# Altium project QUTMS-RADIO-M2M-V00.PrjPcb
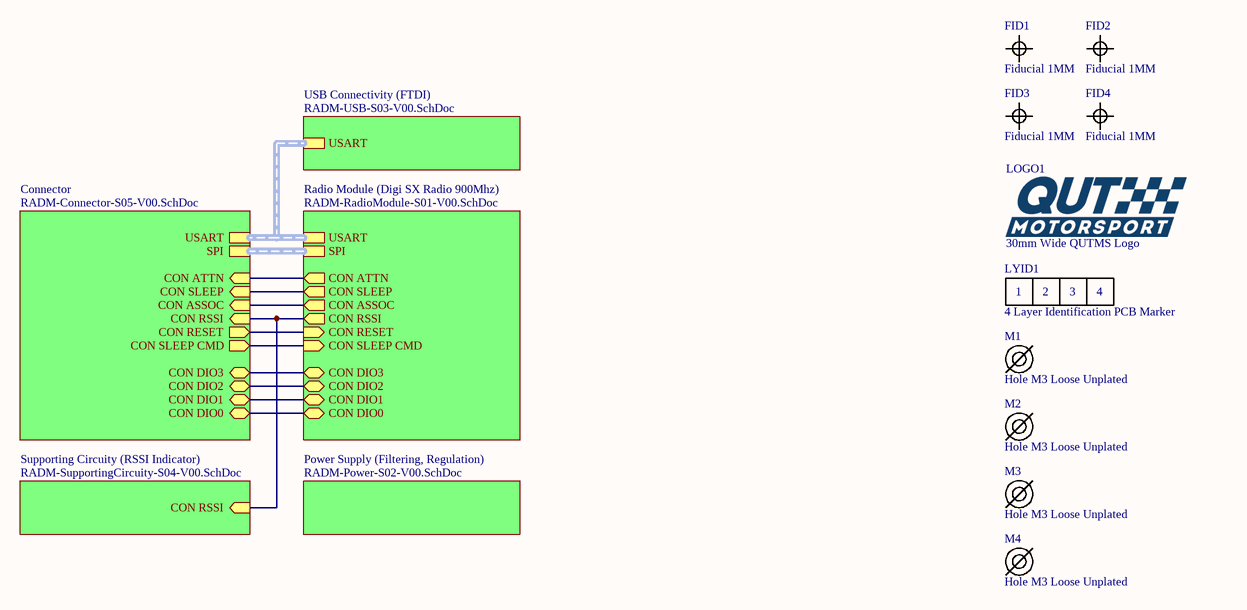
[diagram p0: RADM-Master-S00-V00.SchDoc]
6 sheets, 109 parts. Net scope: hierarchical (ports join the sheet entries above them; power ports are global).
Board file: RADM-B00-V00.PcbDoc
Sheets:
  RADM-Master-S00-V00.SchDoc
    Radio Module (Digi SX Radio 900Mhz) = RADM-RadioModule-S01-V00.SchDoc
    Power Supply (Filtering, Regulation) = RADM-Power-S02-V00.SchDoc
    Supporting Circuity (RSSI Indicator) = RADM-SupportingCircuity-S04-V00.SchDoc
    USB Connectivity (FTDI) = RADM-USB-S03-V00.SchDoc
    Connector = RADM-Connector-S05-V00.SchDoc

## Sheet RADM-Master-S00-V00.SchDoc: RADM Master (Machine 2 Machine Radio, Top Level)
size A3; DrawnBy: Jonn Dillon; DocumentNumber: 1; Revision: 00; SheetNumber: 1; SheetTotal: 6; Version: 00; Project: QUTMS RADIO M2M; PageSetup: Record=PageOptions|CenterHorizontal=True|CenterVertical=True|PrintScale=0.97|XCorrection=1.00|YCorrection=1.00|PrintKind=0|BorderSize=5000000|LeftOffset=0|BottomOffset=0|Orientation=2|PaperLength=1000|PaperWidth=1000|Scale=100|PaperSource=7|PrintQuality=-4|MediaType=1|DitherType=10|PaperKind=A4|PrintScaleMode=1

### Parts
FID1  Fiducial 1MM  [FIDUCIAL 1MM]  (no BOM)
FID2  Fiducial 1MM  [FIDUCIAL 1MM]  (no BOM)
FID3  Fiducial 1MM  [FIDUCIAL 1MM]  (no BOM)
FID4  Fiducial 1MM  [FIDUCIAL 1MM]  (no BOM)
LOGO1  30mm Wide QUTMS Logo  [QUTMS LOGO 30MM]  (no BOM)
LYID1  4 Layer Identification PCB Marker  [LAYER IDENT 4]  (no BOM)
M1  Hole M3 Loose Unplated  [M3.5 UNPLATED]  (no BOM)
M2  Hole M3 Loose Unplated  [M3.5 UNPLATED]  (no BOM)
M3  Hole M3 Loose Unplated  [M3.5 UNPLATED]  (no BOM)
M4  Hole M3 Loose Unplated  [M3.5 UNPLATED]  (no BOM)

### Sub-sheets
Connector = RADM-Connector-S05-V00.SchDoc: USART, SPI, CON ATTN (in), CON SLEEP (in), CON ASSOC (in), CON RSSI (in), CON RESET (out), CON SLEEP CMD (out), CON DIO3 (bidir), CON DIO2 (bidir), CON DIO1 (bidir), CON DIO0 (bidir)
Power Supply (Filtering, Regulation) = RADM-Power-S02-V00.SchDoc: no entries
Radio Module (Digi SX Radio 900Mhz) = RADM-RadioModule-S01-V00.SchDoc: CON ATTN (out), USART (harness USART), SPI (harness SPI), CON RESET (in), CON SLEEP (out), CON ASSOC (out), CON RSSI (out), CON SLEEP CMD (in), CON DIO2 (bidir), CON DIO3 (bidir), CON DIO0 (bidir), CON DIO1 (bidir)
Supporting Circuity (RSSI Indicator) = RADM-SupportingCircuity-S04-V00.SchDoc: CON RSSI (in)
USB Connectivity (FTDI) = RADM-USB-S03-V00.SchDoc: USART

### Nets
CON ASSOC: sheet Radio Module (Digi SX Radio 900Mhz)/CON ASSOC, sheet Connector/CON ASSOC
CON ATTN: sheet Radio Module (Digi SX Radio 900Mhz)/CON ATTN, sheet Connector/CON ATTN
CON DIO0: sheet Radio Module (Digi SX Radio 900Mhz)/CON DIO0, sheet Connector/CON DIO0
CON DIO1: sheet Radio Module (Digi SX Radio 900Mhz)/CON DIO1, sheet Connector/CON DIO1
CON RESET: sheet Radio Module (Digi SX Radio 900Mhz)/CON RESET, sheet Connector/CON RESET
CON RSSI: sheet Radio Module (Digi SX Radio 900Mhz)/CON RSSI, sheet Supporting Circuity (RSSI Indicator)/CON RSSI, sheet Connector/CON RSSI
CON SLEEP: sheet Radio Module (Digi SX Radio 900Mhz)/CON SLEEP, sheet Connector/CON SLEEP
CON SLEEP CMD: sheet Radio Module (Digi SX Radio 900Mhz)/CON SLEEP CMD, sheet Connector/CON SLEEP CMD
(unnamed): sheet Radio Module (Digi SX Radio 900Mhz)/CON DIO2, sheet Connector/CON DIO2
(unnamed): sheet Radio Module (Digi SX Radio 900Mhz)/CON DIO3, sheet Connector/CON DIO3

### Buses and harness runs
harness sheet Connector/SPI = sheet Radio Module (Digi SX Radio 900Mhz)/SPI
harness sheet Connector/USART = sheet Radio Module (Digi SX Radio 900Mhz)/USART = sheet USB Connectivity (FTDI)/USART

### Notes on the sheet
- Revision History:
- Sheet Title:
- Rev
- Date
- Description
- Project:
- Size:
- Drawn By:
- A3
- Number:
- Revision:
- Sheet
- Version:
- of
- QUT Motorsport
- O-120, Gardens Point
- 2 George Street
- Brisbane, QLD 4000
- Australia
- Print Date:
- Print Time:
- File Name:
- (in symbol Layer Identification 4) 1; 2; 3; 4

### Library data of the parts
LOGO1 = QUTMS Logo 30mm
LYID1 = Layer Identification 4
M1-M4 = Hole M3 Loose Unplated: M3.5 Hole, No Plating

## Sheet RADM-RadioModule-S01-V00.SchDoc: RADM Radio Module (Digi SX 915Mhz Radio)
size A3; DrawnBy: Jonn Dillon; DocumentNumber: 2; SheetNumber: 2; SheetTotal: 6; Version: 00; Project: QUTMS RADIO M2M; PageSetup: Record=PageOptions|CenterHorizontal=True|CenterVertical=True|PrintScale=0.97|XCorrection=1.00|YCorrection=1.00|PrintKind=0|BorderSize=5000000|LeftOffset=0|BottomOffset=0|Orientation=2|PaperLength=1000|PaperWidth=1000|Scale=100|PaperSource=7|PrintQuality=-4|MediaType=1|DitherType=10|PaperKind=A4|PrintScaleMode=1
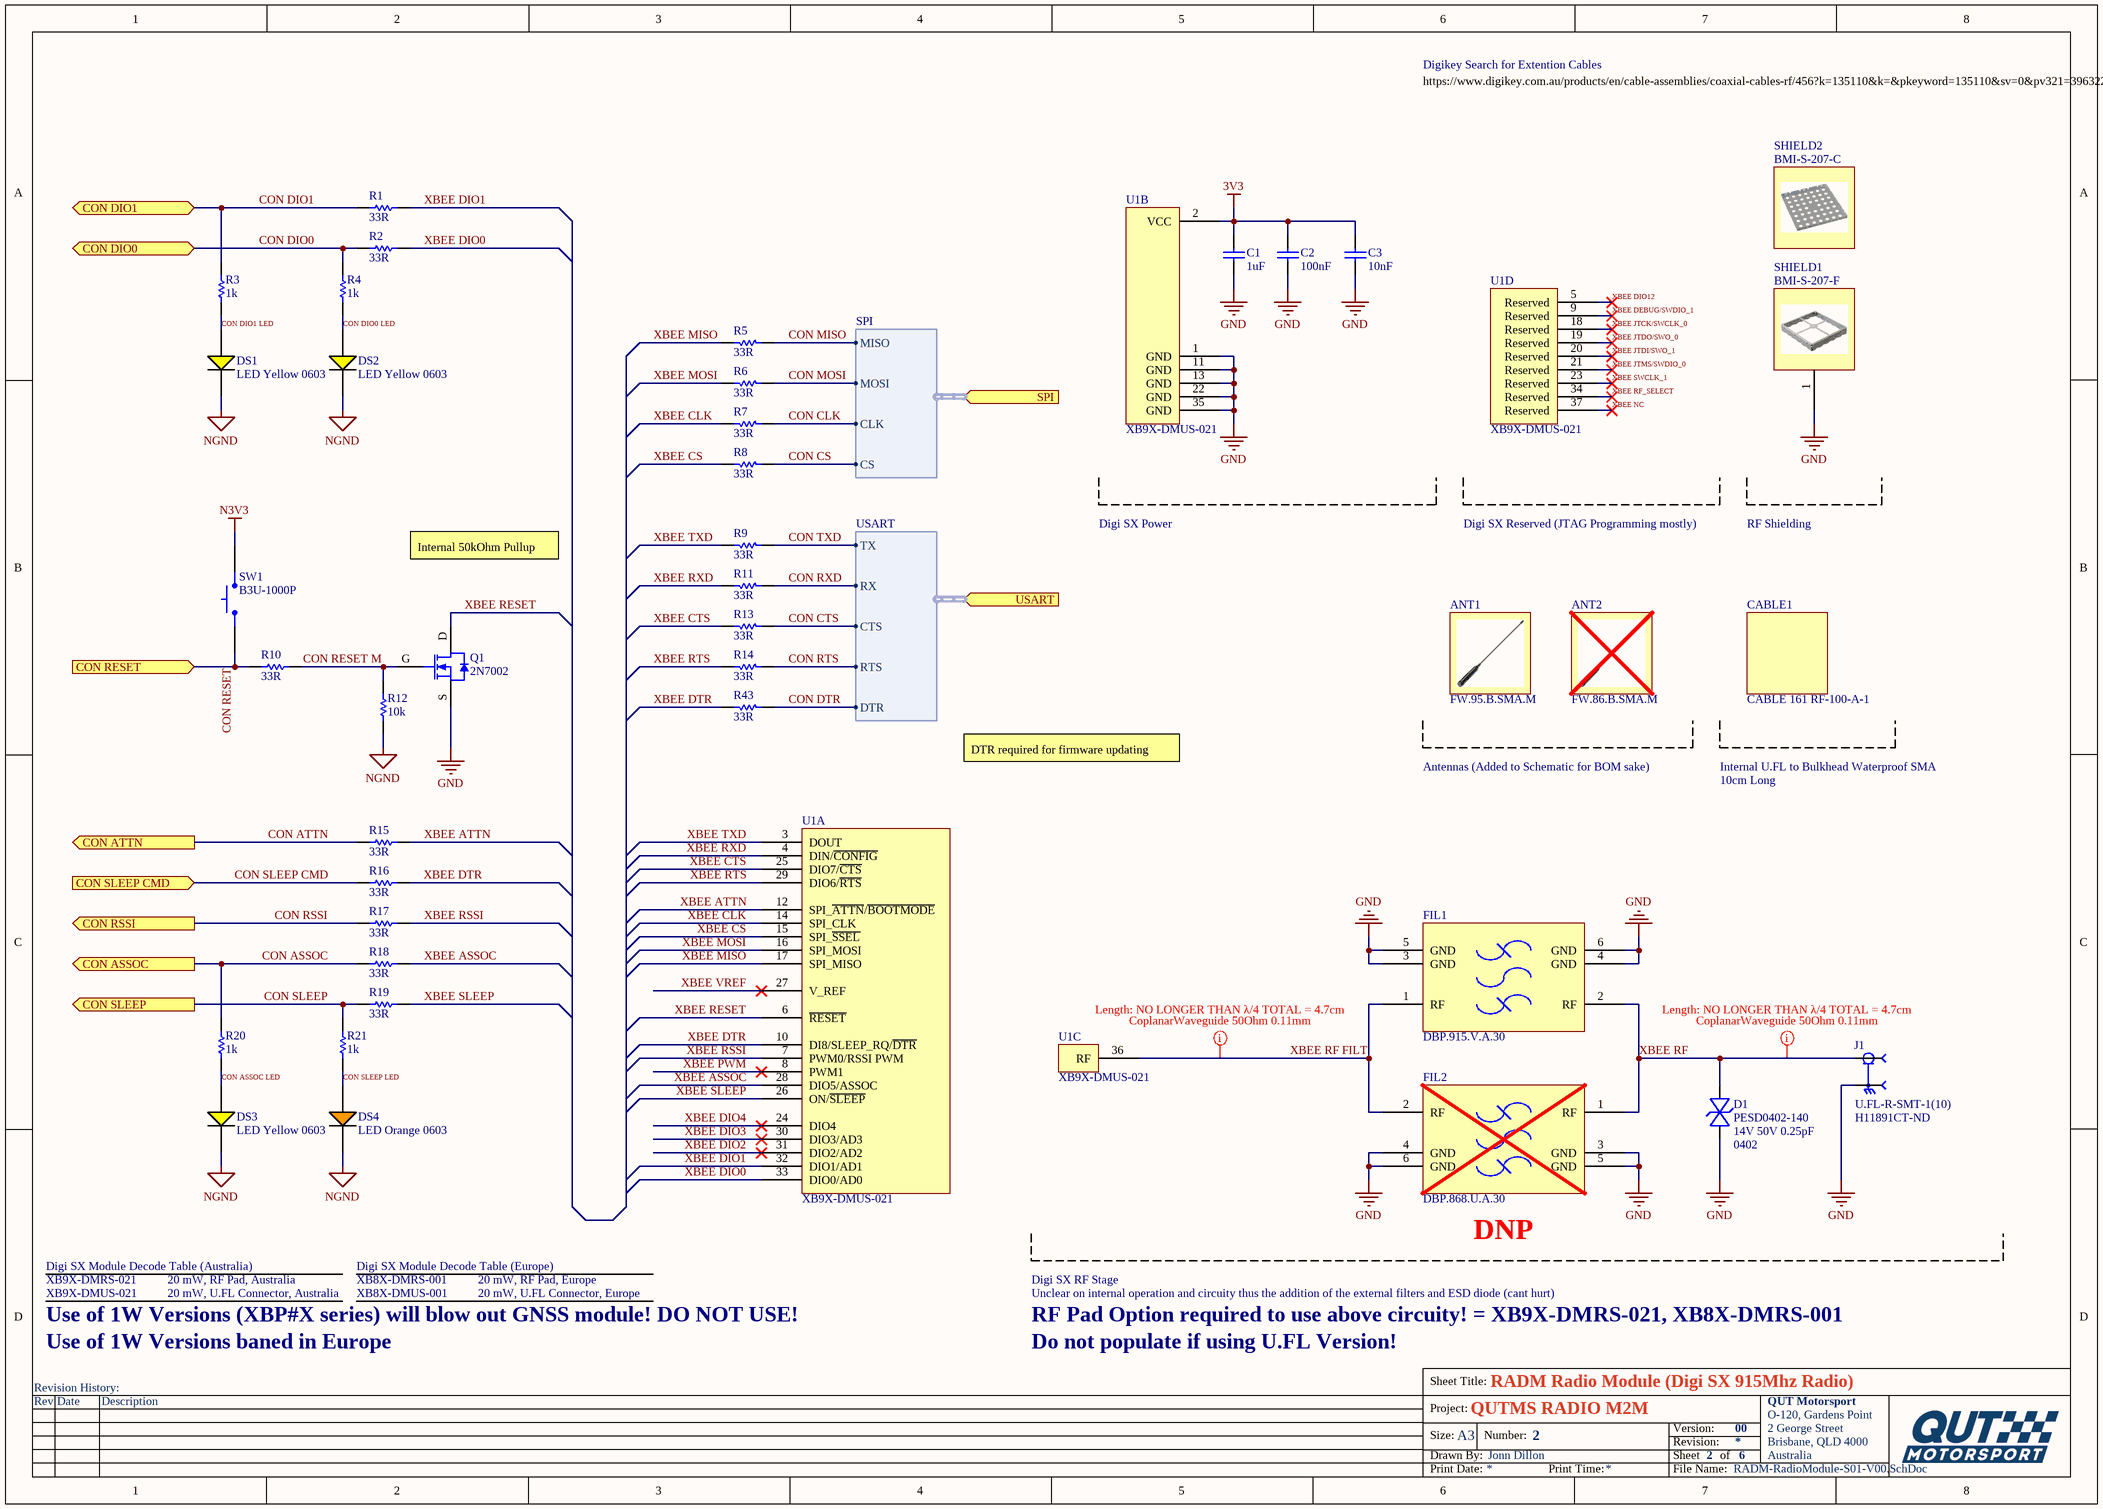
[diagram p1: RADM-RadioModule-S01-V00.SchDoc]

### Parts
ANT1  FW.95.B.SMA.M
ANT2  FW.86.B.SMA.M  (graphical)
C1  1uF  [Cap_Ceramic_0603]
C2  100nF  [Cap_Ceramic_0603]
C3  10nF  [Cap_Ceramic_0603]
CABLE1  CABLE 161 RF-100-A-1
D1  PESD0402-140  [FERRITEBEAD_0402]
DS1  LED Yellow 0603  [LED YELLOW 0603]
DS2  LED Yellow 0603  [LED YELLOW 0603]
DS3  LED Yellow 0603  [LED YELLOW 0603]
DS4  LED Orange 0603  [LED ORANGE 0603]
FIL1  DBP.915.V.A.30  [TAOGLAS 915MHZ FILTER]
FIL2  DBP.868.U.A.30  [TAOGLAS 868MHZ FILTER]  (net tie, no BOM)
J1  U.FL-R-SMT-1(10)  [U.FL-R-SMT HIROSE]
Q1  2N7002  [SOT23-3]
R1  33R  [Res_ThinFilm_0603]
R2  33R  [Res_ThinFilm_0603]
R3  1k  [Res_ThinFilm_0603]
R4  1k  [Res_ThinFilm_0603]
R5  33R  [Res_ThinFilm_0603]
R6  33R  [Res_ThinFilm_0603]
R7  33R  [Res_ThinFilm_0603]
R8  33R  [Res_ThinFilm_0603]
R9  33R  [Res_ThinFilm_0603]
R10  33R  [Res_ThinFilm_0603]
R11  33R  [Res_ThinFilm_0603]
R12  10k  [Res_ThinFilm_0603]
R13  33R  [Res_ThinFilm_0603]
R14  33R  [Res_ThinFilm_0603]
R15  33R  [Res_ThinFilm_0603]
R16  33R  [Res_ThinFilm_0603]
R17  33R  [Res_ThinFilm_0603]
R18  33R  [Res_ThinFilm_0603]
R19  33R  [Res_ThinFilm_0603]
R20  1k  [Res_ThinFilm_0603]
R21  1k  [Res_ThinFilm_0603]
R43  33R  [Res_ThinFilm_0603]
SHIELD1  BMI-S-207-F  [BMI-S-207-F]
SHIELD2  BMI-S-207-C
SW1  B3U-1000P  [BTN B3U-1000P]
U1  XB9X-DMUS-021  [XBee_1W_Base]  (parts A,B,C,D of 4)

### Ports
CON ASSOC (out), CON ATTN (out), CON DIO0 (bidir), CON DIO1 (bidir), CON RESET (in), CON RSSI (out), CON SLEEP (out), CON SLEEP CMD (in), SPI (in, harness SPI), USART (in, harness USART)

### Harnesses
USART: TX, RX, RTS, CTS, DTR
SPI: MISO, MOSI, CLK, CS

### Nets
3V3: C1.2 C2.2 C3.2 U1.2(VCC)
GND: C1.1 C2.1 C3.1 D1.1(Anode) FIL1.3(GND) FIL1.4(GND) FIL1.5(GND) FIL1.6(GND) FIL2.3(GND) FIL2.4(GND) FIL2.5(GND) FIL2.6(GND) J1.2(GND) Q1.S SHIELD1.1 U1.1(GND) U1.11(GND) U1.13(GND) U1.22(GND) U1.35(GND)
N3V3: SW1.2
NGND: DS1.2(C) DS2.2(C) DS3.2(C) DS4.2(C) R12.1
CON ASSOC: R18.1 R20.2 ; port CON ASSOC
CON ASSOC LED: DS3.1(A) R20.1
CON ATTN: R15.1 ; port CON ATTN
CON CLK: R7.1 ; port SPI.CLK
CON CS: R8.1 ; port SPI.CS
CON CTS: R13.1 ; port USART.CTS
CON DIO0: R2.1 R4.2 ; port CON DIO0
CON DIO0 LED: DS2.1(A) R4.1
CON DIO1: R1.1 R3.2 ; port CON DIO1
CON DIO1 LED: DS1.1(A) R3.1
CON DTR: R43.1 ; port USART.DTR
CON MISO: R5.1 ; port SPI.MISO
CON MOSI: R6.1 ; port SPI.MOSI
CON RESET: R10.1 SW1.1 ; port CON RESET
CON RESET M: Q1.G R10.2 R12.2
CON RSSI: R17.1 ; port CON RSSI
CON RTS: R14.1 ; port USART.RTS
CON RXD: R11.1 ; port USART.RX
CON SLEEP: R19.1 R21.2 ; port CON SLEEP
CON SLEEP CMD: R16.1 ; port CON SLEEP CMD
CON SLEEP LED: DS4.1(A) R21.1
CON TXD: R9.1 ; port USART.TX
XBEE ASSOC: R18.2 U1.28(DIO5/ASSOC)
XBEE ATTN: R15.2 U1.12(SPI_~{ATTN}/~{BOOTMODE})
XBEE CLK: R7.2 U1.14(SPI_CLK)
XBEE CS: R8.2 U1.15(SPI_~{SSEL})
XBEE CTS: R13.2 U1.25(DIO7/~{CTS})
XBEE DEBUG/SWDIO_1: U1.9(Reserved)
XBEE DIO0: R2.2 U1.33(DIO0/AD0)
XBEE DIO1: R1.2 U1.32(DIO1/AD1)
XBEE DIO2: U1.31(DIO2/AD2)
XBEE DIO3: U1.30(DIO3/AD3)
XBEE DIO4: U1.24(DIO4)
XBEE DIO12: U1.5(Reserved)
XBEE DTR: R16.2 R43.2 U1.10(DI8/SLEEP_RQ/~{DTR})
XBEE JTCK/SWCLK_0: U1.18(Reserved)
XBEE JTDI/SWO_1: U1.20(Reserved)
XBEE JTDO/SWO_0: U1.19(Reserved)
XBEE JTMS/SWDIO_0: U1.21(Reserved)
XBEE MISO: R5.2 U1.17(SPI_MISO)
XBEE MOSI: R6.2 U1.16(SPI_MOSI)
XBEE NC: U1.37(Reserved)
XBEE PWM: U1.8(PWM1)
XBEE RESET: Q1.D U1.6(~{RESET})
XBEE RF: D1.2(Cathode) FIL1.2(RF) FIL2.1(RF) J1.1(SIG)
XBEE RF FILT: FIL1.1(RF) FIL2.2(RF) U1.36(RF)
XBEE RF_SELECT: U1.34(Reserved)
XBEE RSSI: R17.2 U1.7(PWM0/RSSI_PWM)
XBEE RTS: R14.2 U1.29(DIO6/~{RTS})
XBEE RXD: R11.2 U1.4(DIN/~{CONFIG})
XBEE SLEEP: R19.2 U1.26(ON/~{SLEEP})
XBEE SWCLK_1: U1.23(Reserved)
XBEE TXD: R9.2 U1.3(DOUT)
XBEE VREF: U1.27(V_REF)

### Layout directives
rule Width Constraint [Pref Width = 9mil    Min Width = 9mil    Max Width = 9mil]; rule Impedance Constraint [Min = 49.50    Max = 50.50    ]; rule Clearance Constraint [Clearance = 14.5mil]: XBEE RF, XBEE RF FILT

### Notes on the sheet
- Digikey Search for Extention Cables
- https://www.digikey.com.au/products/en/cable-assemblies/coaxial-cables-rf/456?k=135110&k=&pkeyword=135110&sv=0&pv321=396322&pv321=396362&pv321=396527&pv321=396529&pv2157=u3GHz&pv2157=u12.4GHz&sf=0&FV=-8%7C456&quantity=&ColumnSort=1000011&page=1&stock=1&nstock=1&datasheet=1&pageSize=25
- Internal 50kOhm Pullup
- Digi SX Power
- Digi SX Reserved (JTAG Programming mostly)
- RF Shielding
- DTR required for firmware updating
- Antennas (Added to Schematic for BOM sake)
- Internal U.FL to Bulkhead Waterproof SMA
- 10cm Long
- (near U1) Length: NO LONGER THAN λ/4 TOTAL = 4.7cm
- (near J1) Length: NO LONGER THAN λ/4 TOTAL = 4.7cm
- (near J1) H11891CT-ND
- (near D1) 14V 50V 0.25pF
- (near D1) 0402
- (near FIL2) DNP
- Digi SX Module Decode Table (Australia)
- XB9X-DMRS-021
- XB9X-DMUS-021
- Use of 1W Versions (XBP#X series) will blow out GNSS module! DO NOT USE!
- 20 mW, RF Pad, Australia
- 20 mW, U.FL Connector, Australia
- Digi SX Module Decode Table (Europe)
- XB8X-DMRS-001
- XB8X-DMUS-001
- 20 mW, RF Pad, Europe
- 20 mW, U.FL Connector, Europe
- Digi SX RF Stage
- Unclear on internal operation and circuity thus the addition of the external filters and ESD diode (cant hurt)
- RF Pad Option required to use above circuity! = XB9X-DMRS-021, XB8X-DMRS-001
- Use of 1W Versions baned in Europe
- Do not populate if using U.FL Version!
- Revision History:
- Sheet Title:
- Rev
- Date
- Description
- Project:
- Size:
- Drawn By:
- A3
- Number:
- Revision:
- Sheet
- Version:
- of
- QUT Motorsport
- O-120, Gardens Point
- 2 George Street
- Brisbane, QLD 4000
- Australia
- Print Date:
- Print Time:
- File Name:

### Library data of the parts
ANT1 = FW.95.B.SMA.M: 915MHz ISM Whip, Straight RF Antenna 2.7dBi SMA Male Connector Mount
ANT2 = FW.86.B.SMA.M: 868MHz ISM Whip, Straight RF Antenna 2.8dBi SMA Male Connector Mount
C1 = 1uF 25V 5% X7R 0603: Capacitor, Ceramic, SMD, 1uF, 25V, 5%, X7R, 0603
C2 = 100nF 50V 5% X7R 0603: Capacitor, Ceramic, SMD, 100nF, 50V, 5%, X7R, 0603
C3 = 10nF 50V 5% X7R 0603: Capacitor, Ceramic, SMD, 10nF, 50V, 5%, X7R, 0603
CABLE1 = CABLE 161 RF-100-A-1: Cable Assembly Coaxial U.FL (UMCC), IPEX MHF1 to SMA Female to Female RG-178 3.937" (100.00mm)
D1 = PESD0402-140: 40V Clamp Ipp Tvs Diode Surface Mount 0402
FIL1 = DBP.915.V.A.30: 915MHz Frequency Band Pass RF Filter (Radio Frequency) 5MHz Bandwidth 3.2dB 2-SMD, No Lead
FIL2 = DBP.868.U.A.30: 868MHz Frequency Band Pass RF Filter (Radio Frequency) 4MHz Bandwidth 3dB 2-SMD, No Lead
J1 = U.FL-R-SMT-1(10): U.FL (UMCC) Connector Receptacle, Male Pin 50Ohm Surface Mount Solder,  H11891CT-ND
R1 R2 R5-R11 R13-R19 R43 = 33R 5% 0603: Resistor, SMD, 33R, 0.1W, 5%, 0603
R3 R4 R20 R21 = 1k 5% 0603: Resistor, SMD, 1k, 0.1W, 5%, 0603
R12 = 10k 5% 0603: Resistor, SMD, 10k, 0.1W, 5%, 0603
SHIELD1 = BMI-S-207-F: RF Shield Frame 1.747" (44.37mm) X 1.747" (44.37mm) Solder
SHIELD2 = BMI-S-207-C: RF Shield Cover 1.344" (34.14mm) X 1.468" (37.29mm) Vent Holes in Pattern Snap Fit
SW1 = BTN B3U-1000P: Omron B3U-1000P Ultra Miniture Switch; ComponentLink1Description: LCSC; ComponentLink1URL: https://lcsc.com/product-detail/Tactile-Switches_BRIGHT-TSA063G50-250_C294565.html
U1 = XB9X-DMUS-021: General ISM < 1GHz Transceiver Module 902MHz ~ 928MHz Antenna Not Included, U.FL Surface Mount

## Sheet RADM-Power-S02-V00.SchDoc: RADM Power (Filtering, USB)
size A3; DrawnBy: Jonn Dillon; DocumentNumber: 3; SheetNumber: 3; SheetTotal: 6; Version: 00; Project: QUTMS RADIO M2M; PageSetup: Record=PageOptions|CenterHorizontal=True|CenterVertical=True|PrintScale=0.97|XCorrection=1.00|YCorrection=1.00|PrintKind=0|BorderSize=5000000|LeftOffset=0|BottomOffset=0|Orientation=2|PaperLength=1000|PaperWidth=1000|Scale=100|PaperSource=7|PrintQuality=-4|MediaType=1|DitherType=10|PaperKind=A4|PrintScaleMode=1
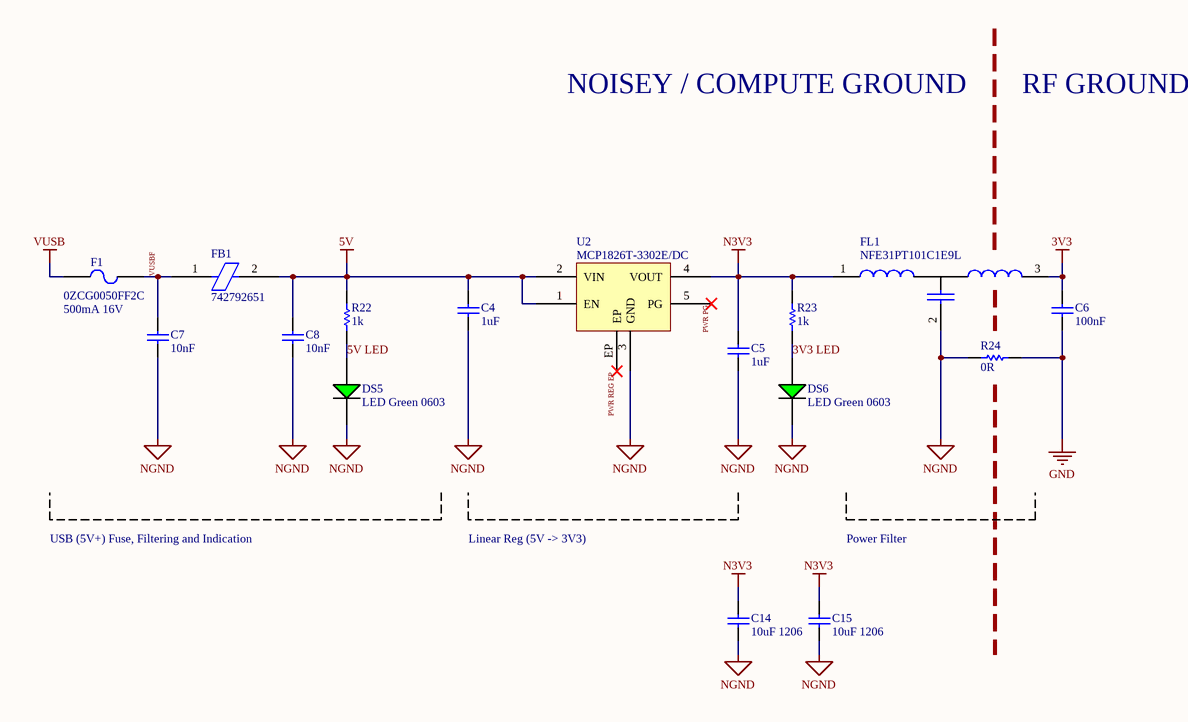
[diagram p2: RADM-Power-S02-V00.SchDoc]

### Parts
C4  1uF  [Cap_Ceramic_0603]
C5  1uF  [Cap_Ceramic_0603]
C6  100nF  [Cap_Ceramic_0603]
C7  10nF  [Cap_Ceramic_0603]
C8  10nF  [Cap_Ceramic_0603]
C14  10uF 1206  [Cap_Ceramic_1206]
C15  10uF 1206  [Cap_Ceramic_1206]
DS5  LED Green 0603  [LED GREEN 0603]
DS6  LED Green 0603  [LED GREEN 0603]
F1  0ZCG0050FF2C  [1812 FUSE]
FB1  742792651  [Inductor_0603]
FL1  NFE31PT101C1E9L  [NFE31PT101C1E9L]
R22  1k  [Res_ThinFilm_0603]
R23  1k  [Res_ThinFilm_0603]
R24  0R  [Res_ThinFilm_0603]
U2  MCP1826T-3302E/DC  [SOT-223-5]

### Nets
3V3: C6.2 FL1.3
5V: C4.2 C8.2 FB1.2 R22.2 U2.1(EN) U2.2(VIN)
GND: C6.1 R24.2
N3V3: C5.2 C14.2 C15.2 FL1.1 R23.2 U2.4(VOUT)
NGND: C4.1 C5.1 C7.1 C8.1 C14.1 C15.1 DS5.2(C) DS6.2(C) FL1.2 R24.1 U2.3(GND)
VUSB: F1.1
3V3 LED: DS6.1(A) R23.1
5V LED: DS5.1(A) R22.1
PWR PG: U2.5(PG)
PWR REG EP: U2.EP
VUSBF: C7.2 F1.2 FB1.1

### Notes on the sheet
- NOISEY / COMPUTE GROUND
- RF GROUND
- 500mA 16V
- USB (5V+) Fuse, Filtering and Indication
- Linear Reg (5V -> 3V3)
- Power Filter
- Revision History:
- Sheet Title:
- Rev
- Date
- Description
- Project:
- Size:
- Drawn By:
- A3
- Number:
- Revision:
- Sheet
- Version:
- of
- QUT Motorsport
- O-120, Gardens Point
- 2 George Street
- Brisbane, QLD 4000
- Australia
- Print Date:
- Print Time:
- File Name:

### Library data of the parts
C4 C5 = 1uF 25V 5% X7R 0603: as C1 on sheet RADM-RadioModule-S01-V00
C6 = 100nF 50V 5% X7R 0603: as C2 on sheet RADM-RadioModule-S01-V00
C7 C8 = 10nF 50V 5% X7R 0603: as C3 on sheet RADM-RadioModule-S01-V00
C14 C15 = 10uF 25V 10% X7R 1206: Capacitor, Ceramic, SMD, 10uF, 25V, 10%, X7R, 1206
F1 = 0ZCG0050FF2C: Polymeric PTC Resettable Fuse 16V 500mA Ih Surface Mount 1812 (4532 Metric), Concave
FB1 = 742792651: 600 Ohms @ 100MHz 1 Signal Line Ferrite Bead 0603 (1608 Metric) 1A 200mOhm
FL1 = NFE31PT101C1E9L: LC (T-Type) EMI Filter 3rd Order Low Pass 1 Channel C = 100pF 6A 1206 (3216 Metric), 3 PC Pad
R22 R23 = 1k 5% 0603: Resistor, SMD, 1k, 0.1W, 5%, 0603
R24 = 0R 5% 0603: Resistor, SMD, 0R, 0.1W, 5%, 0603
U2 = MCP1826T-3302E/DC: Linear Voltage Regulator IC Positive Fixed 1 Output 1A SOT-223-5

## Sheet RADM-SupportingCircuity-S04-V00.SchDoc: RADM Supporting Circuity (RSSI Indicator)
size A3; DrawnBy: Jonn Dillon; DocumentNumber: 5; SheetNumber: 5; SheetTotal: 6; Version: 00; Project: QUTMS RADIO M2M; PageSetup: Record=PageOptions|CenterHorizontal=True|CenterVertical=True|PrintScale=0.97|XCorrection=1.00|YCorrection=1.00|PrintKind=0|BorderSize=5000000|LeftOffset=0|BottomOffset=0|Orientation=2|PaperLength=1000|PaperWidth=1000|Scale=100|PaperSource=7|PrintQuality=-4|MediaType=1|DitherType=10|PaperKind=A4|PrintScaleMode=1
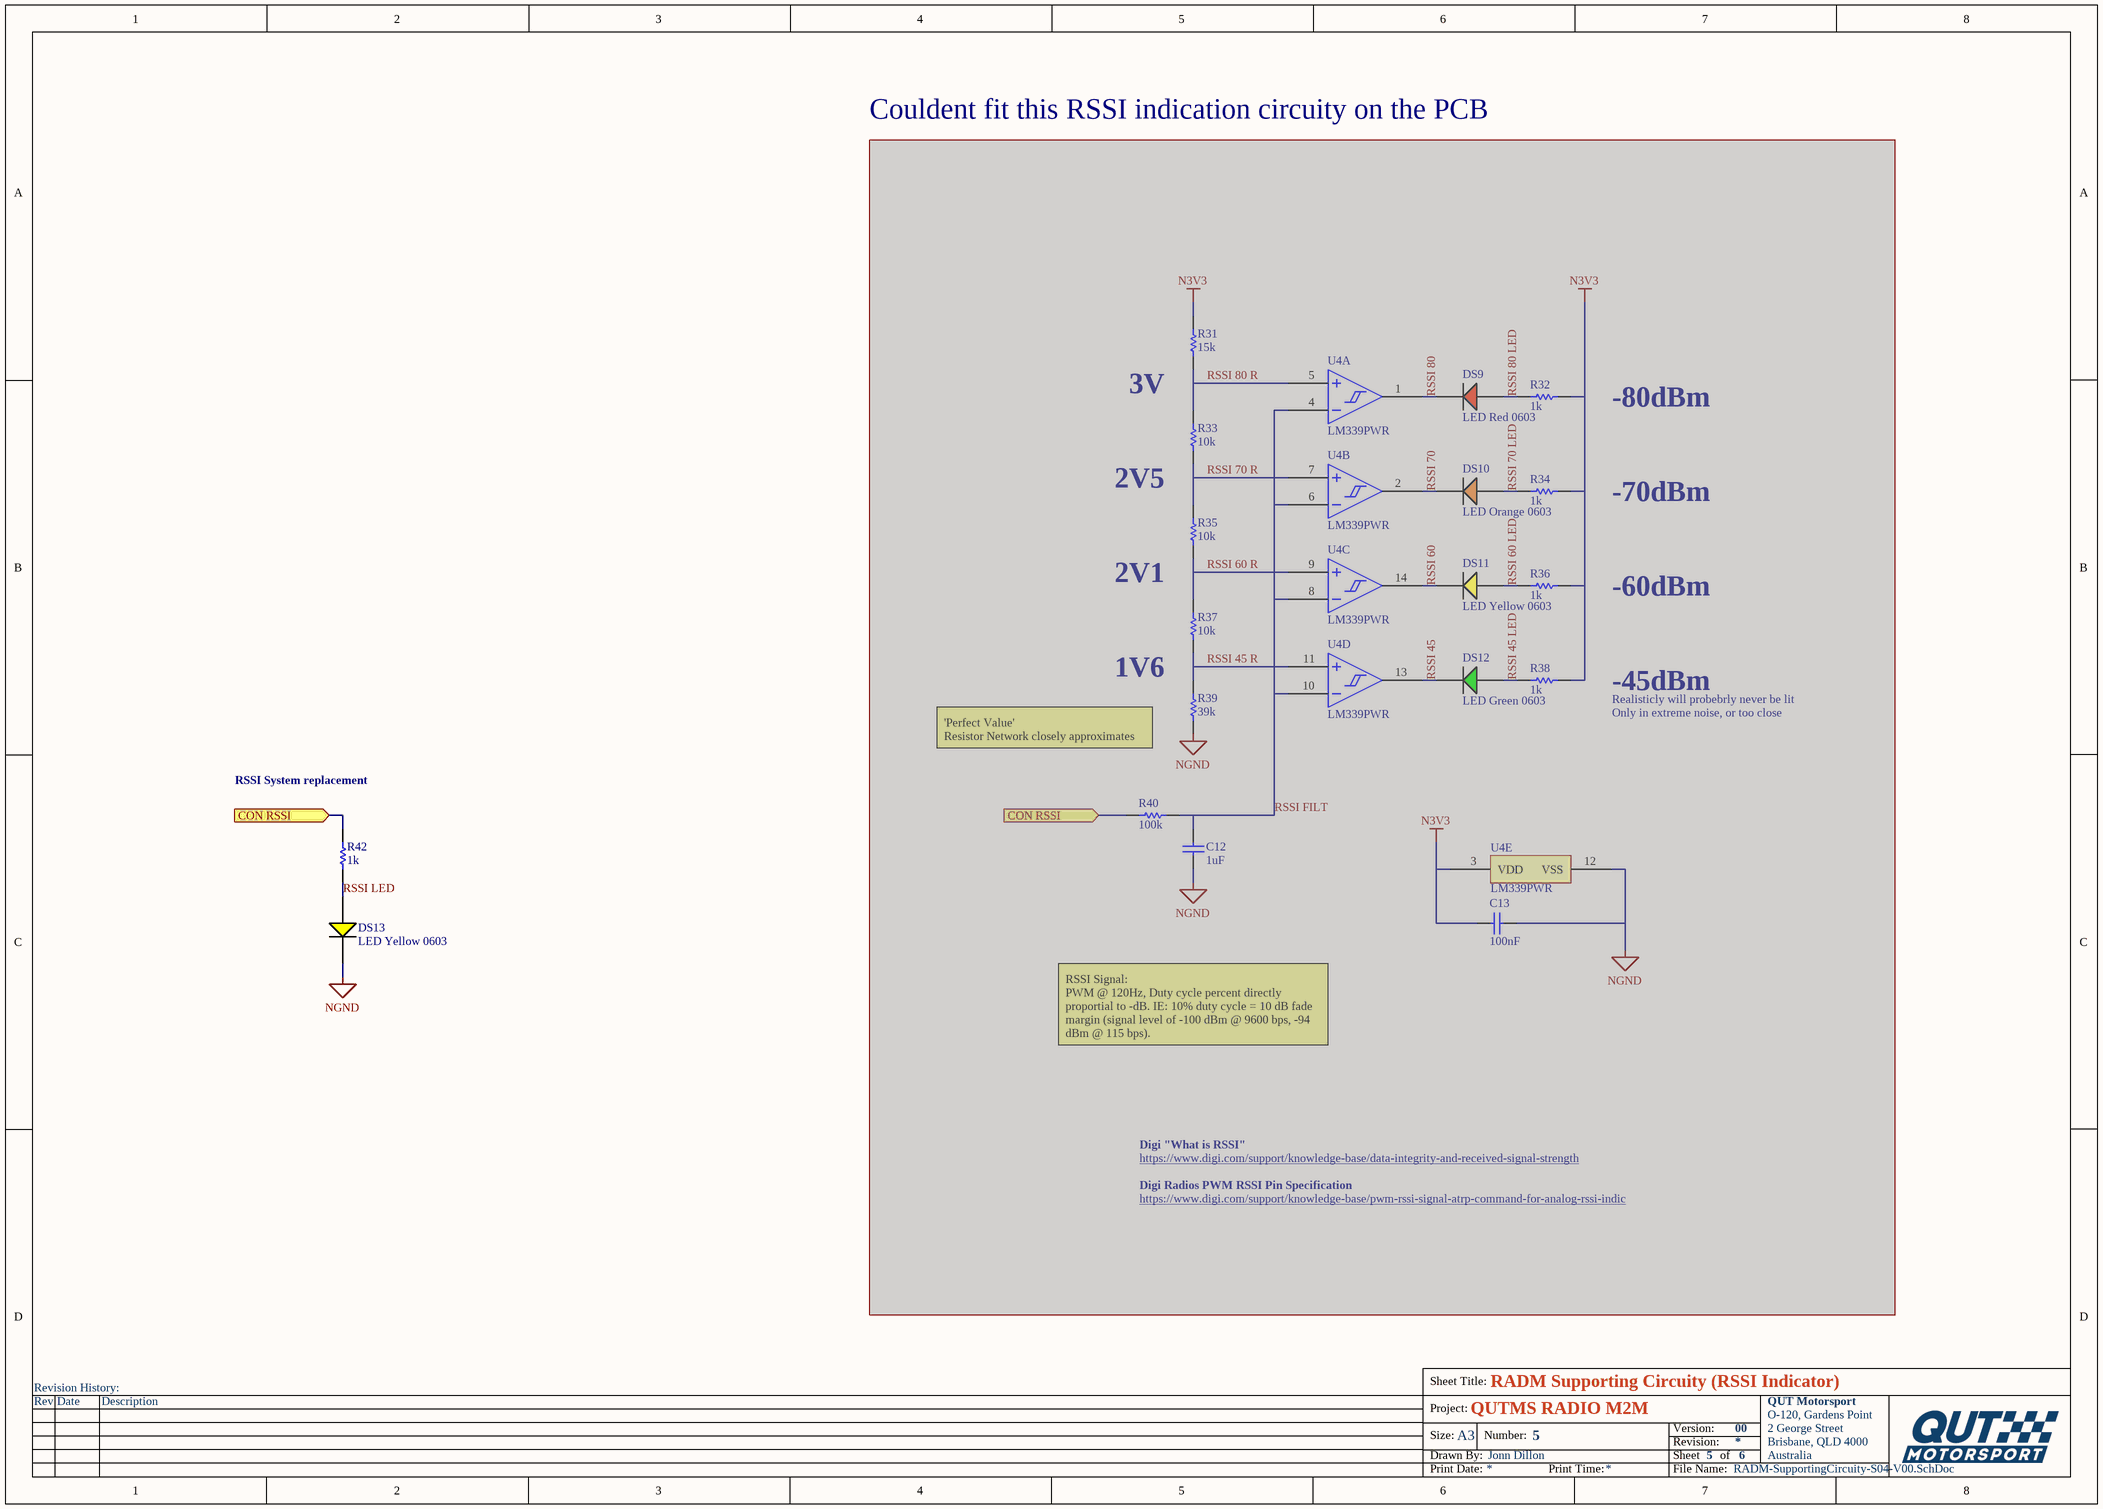
[diagram p3: RADM-SupportingCircuity-S04-V00.SchDoc]

### Parts
C12  1uF  [Cap_Ceramic_0603]  (masked out: inside a compile mask, not in the netlist)
C13  100nF  [Cap_Ceramic_0603]  (masked out: inside a compile mask, not in the netlist)
DS9  LED Red 0603  [LED RED 0603]  (masked out: inside a compile mask, not in the netlist)
DS10  LED Orange 0603  [LED ORANGE 0603]  (masked out: inside a compile mask, not in the netlist)
DS11  LED Yellow 0603  [LED YELLOW 0603]  (masked out: inside a compile mask, not in the netlist)
DS12  LED Green 0603  [LED GREEN 0603]  (masked out: inside a compile mask, not in the netlist)
DS13  LED Yellow 0603  [LED YELLOW 0603]
R31  15k  [Res_ThinFilm_0603]  (masked out: inside a compile mask, not in the netlist)
R32  1k  [Res_ThinFilm_0603]  (masked out: inside a compile mask, not in the netlist)
R33  10k  [Res_ThinFilm_0603]  (masked out: inside a compile mask, not in the netlist)
R34  1k  [Res_ThinFilm_0603]  (masked out: inside a compile mask, not in the netlist)
R35  10k  [Res_ThinFilm_0603]  (masked out: inside a compile mask, not in the netlist)
R36  1k  [Res_ThinFilm_0603]  (masked out: inside a compile mask, not in the netlist)
R37  10k  [Res_ThinFilm_0603]  (masked out: inside a compile mask, not in the netlist)
R38  1k  [Res_ThinFilm_0603]  (masked out: inside a compile mask, not in the netlist)
R39  39k  [Res_ThinFilm_0603]  (masked out: inside a compile mask, not in the netlist)
R40  100k  [Res_ThinFilm_0603]  (masked out: inside a compile mask, not in the netlist)
R42  1k  [Res_ThinFilm_0603]
U4  LM339PWR  [TSSOP-14]  (parts A,B,C,D,E of 5)  (masked out: inside a compile mask, not in the netlist)

### Ports
CON RSSI (in)

### Nets
NGND: DS13.2(C)
CON RSSI: R42.2 ; port CON RSSI
RSSI LED: DS13.1(A) R42.1

### Notes on the sheet
- Couldent fit this RSSI indication circuity on the PCB
- 3V
- -80dBm
- 2V5
- -70dBm
- 2V1
- -60dBm
- 1V6
- -45dBm
- Realisticly will probebrly never be lit
- Only in extreme noise, or too close
- RSSI System replacement
- (near R39) 'Perfect Value'
  Resistor Network closely approximates
- RSSI Signal:
  PWM @ 120Hz, Duty cycle percent directly proportial to -dB. IE: 10% duty cycle = 10 dB fade margin (signal level of -100 dBm @ 9600 bps, -94 dBm @ 115 bps).
- Digi Radios PWM RSSI Pin Specification
- https://www.digi.com/support/knowledge-base/data-integrity-and-received-signal-strength
- Digi "What is RSSI"
- https://www.digi.com/support/knowledge-base/pwm-rssi-signal-atrp-command-for-analog-rssi-indic
- Revision History:
- Sheet Title:
- Rev
- Date
- Description
- Project:
- Size:
- Drawn By:
- A3
- Number:
- Revision:
- Sheet
- Version:
- of
- QUT Motorsport
- O-120, Gardens Point
- 2 George Street
- Brisbane, QLD 4000
- Australia
- Print Date:
- Print Time:
- File Name:

### Library data of the parts
C12 = 1uF 25V 5% X7R 0603: as C1 on sheet RADM-RadioModule-S01-V00
C13 = 100nF 50V 5% X7R 0603: as C2 on sheet RADM-RadioModule-S01-V00
R31 = 15k 5% 0603: Resistor, SMD, 15k, 0.1W, 5%, 0603
R32 R34 R36 R38 R42 = 1k 5% 0603: Resistor, SMD, 1k, 0.1W, 5%, 0603
R33 R35 R37 = 10k 5% 0603: Resistor, SMD, 10k, 0.1W, 5%, 0603
R39 = 39k 5% 0603: Resistor, SMD, 39k, 0.1W, 5%, 0603
R40 = 100k 5%, 0603: Resistor, SMD, 100k, 0.1W, 5%, 0603
U4 = LM339PWR: Comparator Differential CMOS, MOS, Open-Collector, TTL 14-TSSOP

## Sheet RADM-USB-S03-V00.SchDoc: RADM USB (USB-C, FTDI USB -> UART, ESD Protection)
size A3; DrawnBy: Jonn Dillon; DocumentNumber: 4; SheetNumber: 4; SheetTotal: 6; Version: 00; Project: QUTMS RADIO M2M; PageSetup: Record=PageOptions|CenterHorizontal=True|CenterVertical=True|PrintScale=0.97|XCorrection=1.00|YCorrection=1.00|PrintKind=0|BorderSize=5000000|LeftOffset=0|BottomOffset=0|Orientation=2|PaperLength=1000|PaperWidth=1000|Scale=100|PaperSource=7|PrintQuality=-4|MediaType=1|DitherType=10|PaperKind=A4|PrintScaleMode=1
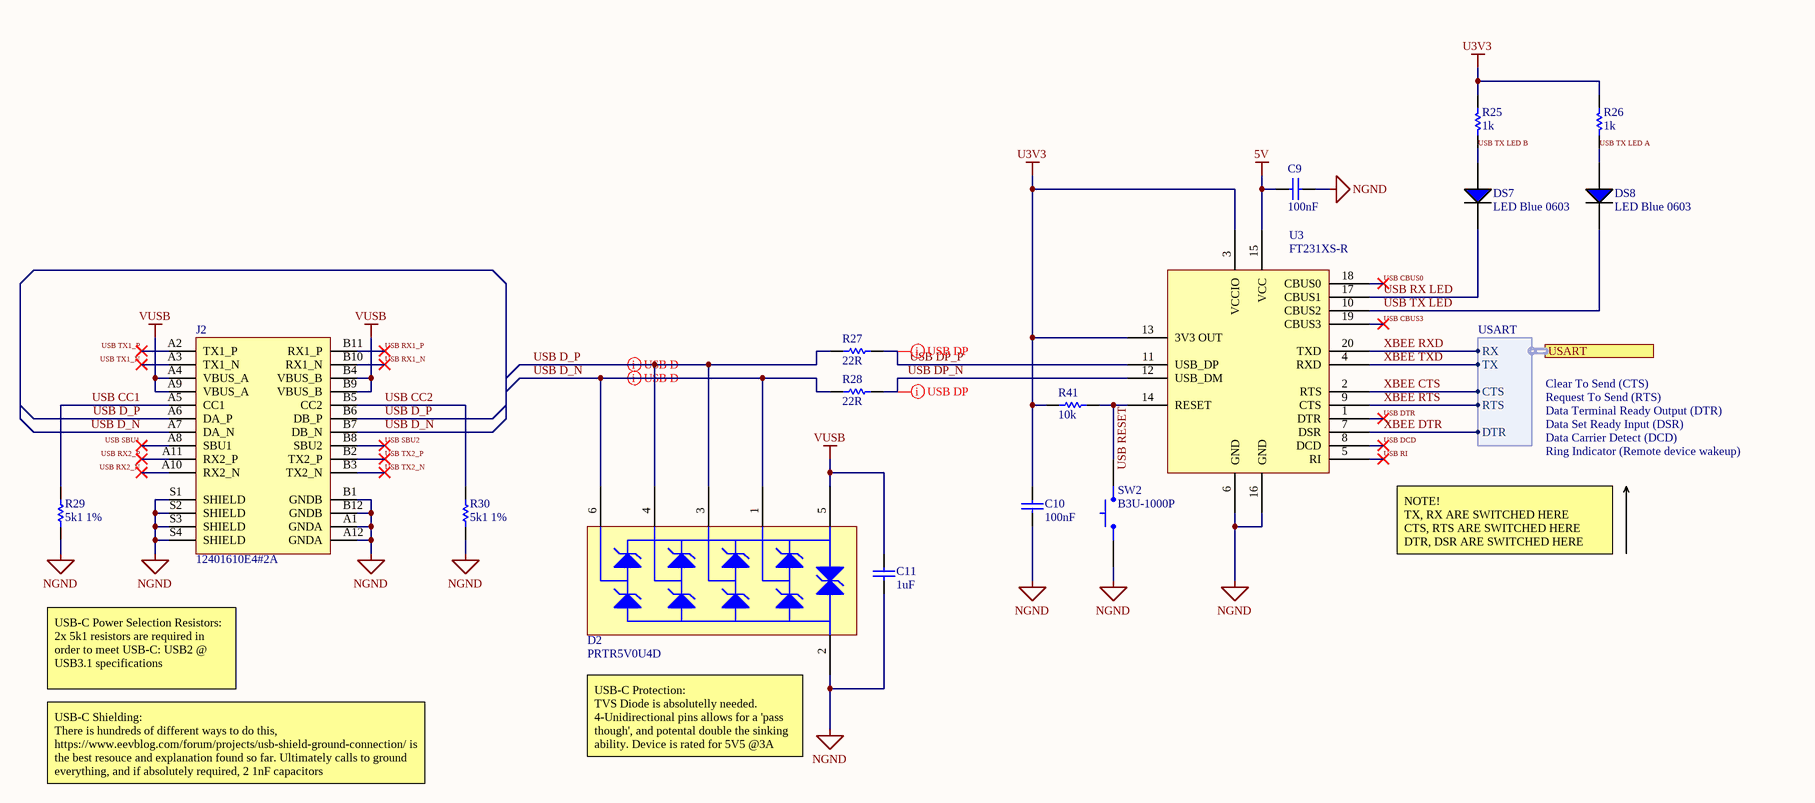
[diagram p4: RADM-USB-S03-V00.SchDoc]

### Parts
C9  100nF  [Cap_Ceramic_0603]
C10  100nF  [Cap_Ceramic_0603]
C11  1uF  [Cap_Ceramic_0603]
D2  PRTR5V0U4D  [SC-47]
DS7  LED Blue 0603  [LED BLUE 0603]
DS8  LED Blue 0603  [LED BLUE 0603]
J2  12401610E4#2A  [12401610E4#2A]
R25  1k  [Res_ThinFilm_0603]
R26  1k  [Res_ThinFilm_0603]
R27  22R  [Res_ThinFilm_0603]
R28  22R  [Res_ThinFilm_0603]
R29  5k1 1%  [Res_ThinFilm_0603]
R30  5k1 1%  [Res_ThinFilm_0603]
R41  10k  [Res_ThinFilm_0603]
SW2  B3U-1000P  [BTN B3U-1000P]
U3  FT231XS-R  [SSOP-20]

### Ports
USART (harness USART)

### Harnesses
USART: TX, RX, RTS, CTS, DTR

### Nets
5V: C9.2 U3.15(VCC)
NGND: C9.1 C10.1 C11.1 D2.2(GND) J2.A1(GNDA) J2.A12(GNDA) J2.B1(GNDB) J2.B12(GNDB) J2.S1(SHIELD) J2.S2(SHIELD) J2.S3(SHIELD) J2.S4(SHIELD) R29.1 R30.1 SW2.1 U3.6(GND) U3.16(GND)
U3V3: C10.2 R25.1 R26.1 R41.1 U3.3(VCCIO) U3.13(3V3_OUT)
VUSB: C11.2 D2.5(VCC) J2.A4(VBUS_A) J2.A9(VBUS_A) J2.B4(VBUS_B) J2.B9(VBUS_B)
USB CBUS0: U3.18(CBUS0)
USB CBUS3: U3.19(CBUS3)
USB CC1: J2.A5(CC1) R29.2
USB CC2: J2.B5(CC2) R30.2
USB D_N: D2.1(P1) D2.6(P4) J2.A7(DA_N) J2.B7(DB_N) R28.1
USB D_P: D2.3(P2) D2.4(P3) J2.A6(DA_P) J2.B6(DB_P) R27.1
USB DCD: U3.8(DCD)
USB DP_N: R28.2 U3.12(USB_DM)
USB DP_P: R27.2 U3.11(USB_DP)
USB DTR: U3.1(DTR)
USB RESET: R41.2 SW2.2 U3.14(RESET)
USB RI: U3.5(RI)
USB RX1_N: J2.B10(RX1_N)
USB RX1_P: J2.B11(RX1_P)
USB RX2_N: J2.A10(RX2_N)
USB RX2_P: J2.A11(RX2_P)
USB RX LED: DS7.2(C) U3.17(CBUS1)
USB SBU1: J2.A8(SBU1)
USB SBU2: J2.B8(SBU2)
USB TX1_N: J2.A3(TX1_N)
USB TX1_P: J2.A2(TX1_P)
USB TX2_N: J2.B3(TX2_N)
USB TX2_P: J2.B2(TX2_P)
USB TX LED: DS8.2(C) U3.10(CBUS2)
USB TX LED A: DS8.1(A) R26.2
USB TX LED B: DS7.1(A) R25.2
XBEE CTS: U3.2(RTS) ; port USART.CTS  [project net CON CTS]
XBEE DTR: U3.7(DSR) ; port USART.DTR  [project net CON DTR]
XBEE RTS: U3.9(CTS) ; port USART.RTS  [project net CON RTS]
XBEE RXD: U3.20(TXD) ; port USART.RX  [project net CON RXD]
XBEE TXD: U3.4(RXD) ; port USART.TX  [project net CON TXD]

### Layout directives
differential pair: USB D_N, USB D_P, USB DP_N, USB DP_P

### Notes on the sheet
- Data Set Ready Input (DSR)
- Data Carrier Detect (DCD)
- Data Terminal Ready Output (DTR)
- Clear To Send (CTS)
- Request To Send (RTS)
- Ring Indicator (Remote device wakeup)
- NOTE!
  TX, RX ARE SWITCHED HERE
  CTS, RTS ARE SWITCHED HERE
  DTR, DSR ARE SWITCHED HERE
- USB-C Power Selection Resistors:
  2x 5k1 resistors are required in order to meet USB-C: USB2 @ USB3.1 specifications
- USB-C Shielding:
  There is hundreds of different ways to do this, https://www.eevblog.com/forum/projects/usb-shield-ground-connection/ is the best resouce and explanation found so far. Ultimately calls to ground everything, and if absolutely required, 2 1nF capacitors
- (near D2) USB-C Protection:
  TVS Diode is absolutelly needed. 4-Unidirectional pins allows for a 'pass though', and potental double the sinking ability. Device is rated for 5V5 @3A
- Revision History:
- Sheet Title:
- Rev
- Date
- Description
- Project:
- Size:
- Drawn By:
- A3
- Number:
- Revision:
- Sheet
- Version:
- of
- QUT Motorsport
- O-120, Gardens Point
- 2 George Street
- Brisbane, QLD 4000
- Australia
- Print Date:
- Print Time:
- File Name:

### Library data of the parts
C9 C10 = 100nF 50V 5% X7R 0603: as C2 on sheet RADM-RadioModule-S01-V00
C11 = 1uF 25V 5% X7R 0603: as C1 on sheet RADM-RadioModule-S01-V00
D2 = PRTR5V0U4D: Clamp Ipp Tvs Diode Surface Mount 6-TSOP
J2 = 12401610E4#2A: USB-C (USB TYPE-C) USB 3.2 Gen 2 (USB 3.1 Gen 2, Superspeed + (USB 3.1)) Receptacle Connector 24 Position Surface Mount, Right Angle; Through Hole
R25 R26 = 1k 5% 0603: Resistor, SMD, 1k, 0.1W, 5%, 0603
R27 R28 = 22R 5% 0603: Resistor, SMD, 22R, 0.1W, 5%, 0603
R29 R30 = 5k1 1% 0603: Resistor, SMD, 5k1, 0.1W, 1%, 0603
R41 = 10k 5% 0603: Resistor, SMD, 10k, 0.1W, 5%, 0603
SW2 = BTN B3U-1000P: Omron B3U-1000P Ultra Miniture Switch; ComponentLink1Description: LCSC; ComponentLink1URL: https://lcsc.com/product-detail/Tactile-Switches_BRIGHT-TSA063G50-250_C294565.html
U3 = FT231XS-R: USB Bridge, USB to UART USB 2.0 UART Interface 20-SSOP

## Sheet RADM-Connector-S05-V00.SchDoc: RADM Connector (Logic Analyser Header, 60Pin 0.5mm FFC)
size A3; DrawnBy: Jonn Dillon; DocumentNumber: 6; SheetNumber: 6; SheetTotal: 6; Version: 00; Project: QUTMS RADIO M2M; PageSetup: Record=PageOptions|CenterHorizontal=True|CenterVertical=True|PrintScale=0.97|XCorrection=1.00|YCorrection=1.00|PrintKind=0|BorderSize=5000000|LeftOffset=0|BottomOffset=0|Orientation=2|PaperLength=1000|PaperWidth=1000|Scale=100|PaperSource=7|PrintQuality=-4|MediaType=1|DitherType=10|PaperKind=A4|PrintScaleMode=1
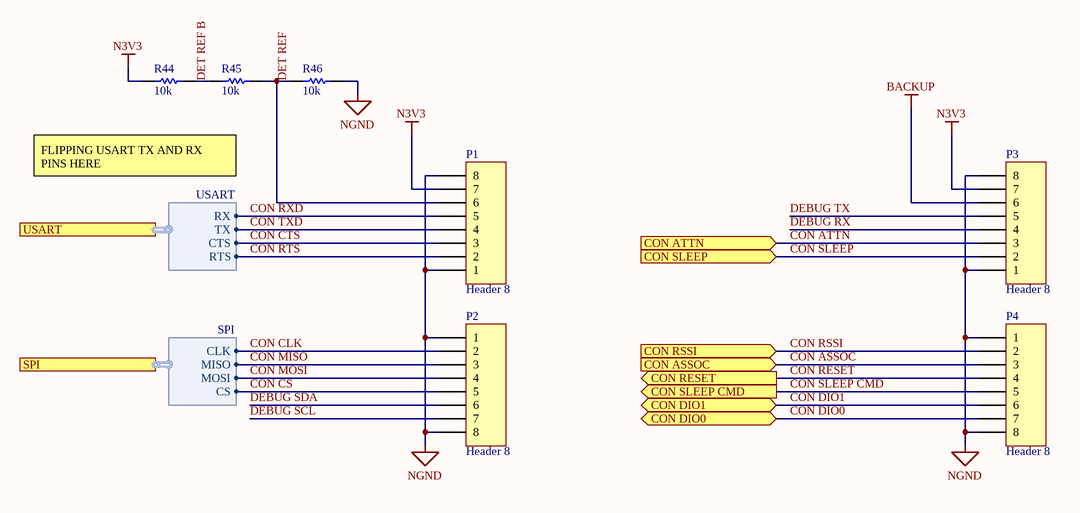
[diagram p5: RADM-Connector-S05-V00.SchDoc]

### Parts
P1  Header 8  [HDR1X8]
P2  Header 8  [HDR1X8]
P3  Header 8  [HDR1X8]
P4  Header 8  [HDR1X8]
R44  10k  [Res_ThinFilm_0603]
R45  10k  [Res_ThinFilm_0603]
R46  10k  [Res_ThinFilm_0603]

### Ports
CON ASSOC (in), CON ATTN (in), CON DIO0 (bidir), CON DIO1 (bidir), CON RESET (out), CON RSSI (in), CON SLEEP (in), CON SLEEP CMD (out), SPI (harness SPI), USART (harness USART)

### Harnesses
SPI: MISO, MOSI, CLK, CS
USART: TX, RX, RTS, CTS

### Nets
BACKUP: P3.6
N3V3: P1.7 P3.7 R44.1
NGND: P1.1 P1.8 P2.1 P2.8 P3.1 P3.8 P4.1 P4.8 R46.2
CON ASSOC: P4.3 ; port CON ASSOC
CON ATTN: P3.3 ; port CON ATTN
CON CLK: P2.2 ; port SPI.CLK
CON CS: P2.5 ; port SPI.CS
CON CTS: P1.3 ; port USART.CTS
CON DIO0: P4.7 ; port CON DIO0
CON DIO1: P4.6 ; port CON DIO1
CON MISO: P2.3 ; port SPI.MISO
CON MOSI: P2.4 ; port SPI.MOSI
CON RESET: P4.4 ; port CON RESET
CON RSSI: P4.2 ; port CON RSSI
CON RTS: P1.2 ; port USART.RTS
CON RXD: P1.5 ; port USART.RX
CON SLEEP: P3.2 ; port CON SLEEP
CON SLEEP CMD: P4.5 ; port CON SLEEP CMD
CON TXD: P1.4 ; port USART.TX
DEBUG RX: P3.4
DEBUG SCL: P2.7
DEBUG SDA: P2.6
DEBUG TX: P3.5
DET REF: P1.6 R45.2 R46.1
DET REF B: R44.2 R45.1

### Notes on the sheet
- FLIPPING USART TX AND RX PINS HERE
- Revision History:
- Sheet Title:
- Rev
- Date
- Description
- Project:
- Size:
- Drawn By:
- A3
- Number:
- Revision:
- Sheet
- Version:
- of
- QUT Motorsport
- O-120, Gardens Point
- 2 George Street
- Brisbane, QLD 4000
- Australia
- Print Date:
- Print Time:
- File Name:

### Library data of the parts
P1-P4 = Header 8: Header, 8-Pin; LatestRevisionDate: 17-Jul-2002; LatestRevisionNote: Re-released for DXP Platform.; Publisher: Altium Limited
R44-R46 = 10k 5% 0603: Resistor, SMD, 10k, 0.1W, 5%, 0603

## Nets that join several sheets
3V3: RADM-RadioModule-S01-V00 (C1.2 C2.2 C3.2 U1.2), RADM-Power-S02-V00 (C6.2 FL1.3)
5V: RADM-Power-S02-V00 (6 pins), RADM-USB-S03-V00 (C9.2 U3.15)
GND: RADM-RadioModule-S01-V00 (20 pins), RADM-Power-S02-V00 (C6.1 R24.2)
N3V3: RADM-RadioModule-S01-V00 (SW1.2), RADM-Power-S02-V00 (6 pins), RADM-Connector-S05-V00 (P1.7 P3.7 R44.1)
NGND: RADM-RadioModule-S01-V00 (5 pins), RADM-Power-S02-V00 (11 pins), RADM-SupportingCircuity-S04-V00 (DS13.2), RADM-USB-S03-V00 (17 pins), RADM-Connector-S05-V00 (9 pins)
VUSB: RADM-Power-S02-V00 (F1.1), RADM-USB-S03-V00 (6 pins)
CON ASSOC: RADM-RadioModule-S01-V00 (R18.1 R20.2), RADM-Connector-S05-V00 (P4.3)
CON ATTN: RADM-RadioModule-S01-V00 (R15.1), RADM-Connector-S05-V00 (P3.3)
CON CLK: RADM-RadioModule-S01-V00 (R7.1), RADM-Connector-S05-V00 (P2.2)
CON CS: RADM-RadioModule-S01-V00 (R8.1), RADM-Connector-S05-V00 (P2.5)
CON CTS: RADM-RadioModule-S01-V00 (R13.1), RADM-USB-S03-V00 (U3.2), RADM-Connector-S05-V00 (P1.3)
CON DIO0: RADM-RadioModule-S01-V00 (R2.1 R4.2), RADM-Connector-S05-V00 (P4.7)
CON DIO1: RADM-RadioModule-S01-V00 (R1.1 R3.2), RADM-Connector-S05-V00 (P4.6)
CON DTR: RADM-RadioModule-S01-V00 (R43.1), RADM-USB-S03-V00 (U3.7)
CON MISO: RADM-RadioModule-S01-V00 (R5.1), RADM-Connector-S05-V00 (P2.3)
CON MOSI: RADM-RadioModule-S01-V00 (R6.1), RADM-Connector-S05-V00 (P2.4)
CON RESET: RADM-RadioModule-S01-V00 (R10.1 SW1.1), RADM-Connector-S05-V00 (P4.4)
CON RSSI: RADM-RadioModule-S01-V00 (R17.1), RADM-SupportingCircuity-S04-V00 (R42.2), RADM-Connector-S05-V00 (P4.2)
CON RTS: RADM-RadioModule-S01-V00 (R14.1), RADM-USB-S03-V00 (U3.9), RADM-Connector-S05-V00 (P1.2)
CON RXD: RADM-RadioModule-S01-V00 (R11.1), RADM-USB-S03-V00 (U3.20), RADM-Connector-S05-V00 (P1.5)
CON SLEEP: RADM-RadioModule-S01-V00 (R19.1 R21.2), RADM-Connector-S05-V00 (P3.2)
CON SLEEP CMD: RADM-RadioModule-S01-V00 (R16.1), RADM-Connector-S05-V00 (P4.5)
CON TXD: RADM-RadioModule-S01-V00 (R9.1), RADM-USB-S03-V00 (U3.4), RADM-Connector-S05-V00 (P1.4)